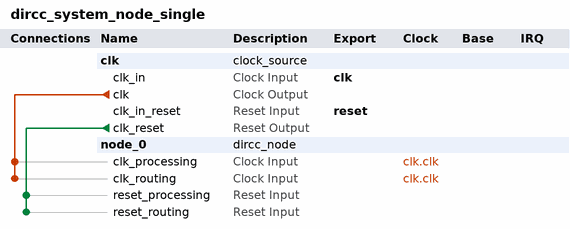
[diagram p0: system contents]
# Platform Designer (Qsys) system dircc_system_node_single, Cyclone V 5CSEMA5F31C6
# Parameters at their usual value, and those the tool derives, are not listed.
package require -exact qsys 16.1
create_system dircc_system_node_single
set_project_property DEVICE_FAMILY {Cyclone V}
set_project_property DEVICE 5CSEMA5F31C6

add_instance clk clock_source 16.1
set_instance_parameter_value clk clockFrequency 50000000
set_instance_parameter_value clk resetSynchronousEdges DEASSERT

add_instance node_0 dircc_node 1.0
set_instance_parameter_value node_0 ADDRESS 1

# connections
add_connection clk.clk node_0.clk_processing clock
add_connection clk.clk node_0.clk_routing clock
add_connection clk.clk_reset node_0.reset_processing reset
add_connection clk.clk_reset node_0.reset_routing reset

# exported interfaces
add_interface clk clock sink
set_interface_property clk EXPORT_OF clk.clk_in
add_interface reset reset sink
set_interface_property reset EXPORT_OF clk.clk_in_reset

set_interconnect_requirement {$system} qsys_mm.clockCrossingAdapter HANDSHAKE
set_interconnect_requirement {$system} qsys_mm.enableEccProtection FALSE
set_interconnect_requirement {$system} qsys_mm.insertDefaultSlave FALSE
set_interconnect_requirement {$system} qsys_mm.maxAdditionalLatency 1

save_system dircc_system_node_single.qsys
